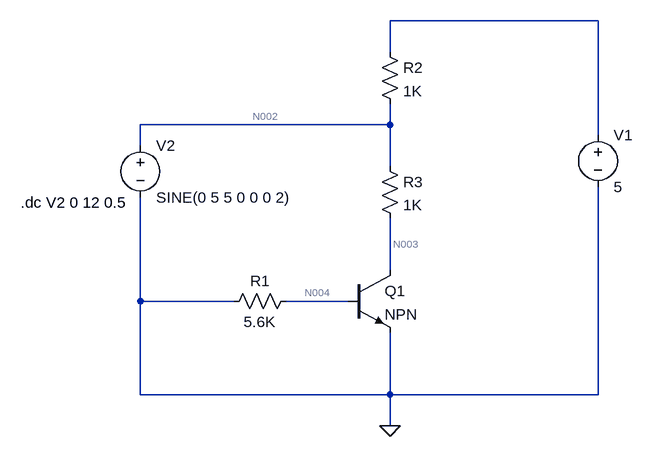
[diagram p0: schematic Draft1.asc]
Draft1.asc, the LTspice schematic file:
Version 4
SHEET 1 880 680
WIRE 640 -144 320 -144
WIRE 320 -96 320 -144
WIRE 320 16 320 -16
WIRE 320 16 -64 16
WIRE 640 32 640 -144
WIRE -64 48 -64 16
WIRE 320 80 320 16
WIRE 320 240 320 160
WIRE -64 288 -64 128
WIRE 80 288 -64 288
WIRE 256 288 160 288
WIRE -64 432 -64 288
WIRE 320 432 320 336
WIRE 320 432 -64 432
WIRE 640 432 640 112
WIRE 640 432 320 432
WIRE 320 480 320 432
FLAG 320 480 0
SYMBOL res 176 272 R90
WINDOW 0 0 56 VBottom 2
WINDOW 3 32 56 VTop 2
SYMATTR InstName R1
SYMATTR Value 5.6K
SYMBOL res 304 -112 R0
SYMATTR InstName R2
SYMATTR Value 1K
SYMBOL res 304 64 R0
SYMATTR InstName R3
SYMATTR Value 1K
SYMBOL npn 256 240 R0
SYMATTR InstName Q1
SYMBOL voltage 640 16 R0
SYMATTR InstName V1
SYMATTR Value 5
SYMBOL voltage -64 32 R0
SYMATTR InstName V2
SYMATTR Value SINE(0 5 5 0 0 0 2)
TEXT -248 136 Left 2 !.dc V2 0 12 0.5

The netlist it stands for:
* Draft1.asc
R1 N004 0 5.6K
R2 N001 N002 1K
R3 N002 N003 1K
Q1 N003 N004 0 0 NPN
V1 N001 0 5
V2 N002 0 SINE(0 5 5 0 0 0 2)
.model NPN NPN
.model PNP PNP
.lib standard.bjt
.dc V2 0 12 0.5
.backanno
.end

* Results of the author's LTspice run, read from the files saved beside the schematic
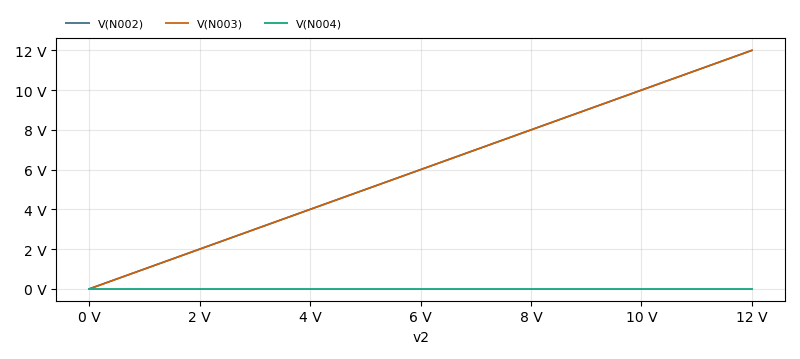
[diagram p1: DC transfer characteristic of Draft1.asc, plotted from the saved traces]
* DC transfer characteristic, 1 run:
*   V(N002): 0 V at v2=0 V, 12 V at v2=12 V, min 0 V, max 12 V
*   V(N003): 4.515e-18 fV at v2=0 V, 12 V at v2=12 V, min 4.515e-18 fV, max 12 V
*   V(N004): -7.67e-18 fV at v2=0 V, 67.2 nV at v2=12 V, min -7.67e-18 fV, max 67.2 nV